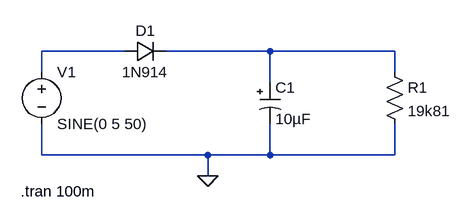
[diagram p0: schematic 1_half_period_rectifier.asc]
1_half_period_rectifier.asc, the LTspice schematic file:
Version 4
SHEET 1 880 680
WIRE 128 112 0 112
WIRE 352 112 192 112
WIRE 544 112 352 112
WIRE 0 144 0 112
WIRE 544 144 544 112
WIRE 352 160 352 112
WIRE 0 272 0 224
WIRE 256 272 0 272
WIRE 352 272 352 224
WIRE 352 272 256 272
WIRE 544 272 544 224
WIRE 544 272 352 272
WIRE 256 304 256 272
FLAG 256 304 0
SYMBOL diode 128 128 R270
WINDOW 0 32 32 VTop 2
WINDOW 3 0 32 VBottom 2
SYMATTR InstName D1
SYMATTR Value 1N914
SYMBOL res 528 128 R0
SYMATTR InstName R1
SYMATTR Value 19k81
SYMBOL polcap 336 160 R0
SYMATTR InstName C1
SYMATTR Value 10µF
SYMBOL voltage 0 128 R0
WINDOW 123 0 0 Left 2
WINDOW 39 0 0 Left 2
SYMATTR InstName V1
SYMATTR Value SINE(0 5 50)
TEXT -32 328 Left 2 !.tran 100m

The netlist it stands for:
* 1_half_period_rectifier.asc
D1 N001 N002 1N914
R1 N002 0 19k81
C1 N002 0 10µF
V1 N001 0 SINE(0 5 50)
.model D D
.lib standard.dio
.tran 100m
.backanno
.end